# Altium schematic sheet Strum.SchDoc
size A; SheetNumber: 1; SheetTotal: 1
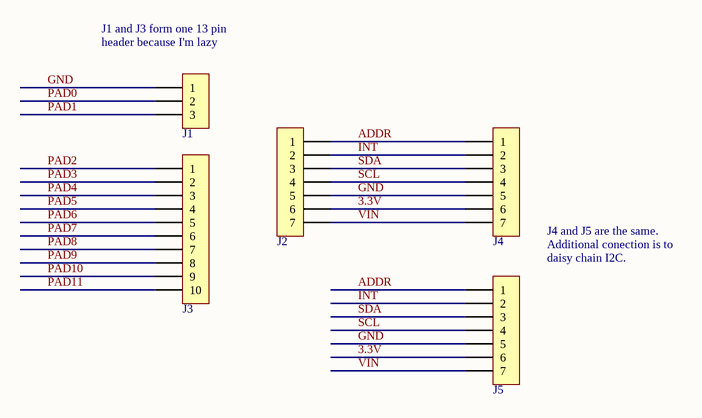
[diagram p0: Strum.SchDoc]

## Parts
J1  3-644456-3  [TE_3-644456-3]  (value not drawn)
J2  3-644456-7  [TE_3-644456-7]  (value not drawn)
J3  4-644456-0  [TE_4-644456-0]  (value not drawn)
J4  3-644456-7  [TE_3-644456-7]  (value not drawn)
J5  3-644456-7  [TE_3-644456-7]  (value not drawn)

## Nets
3.3V: J2.6 J4.6 J5.6
ADDR: J2.1 J4.1 J5.1
GND: J1.1 J2.5 J4.5 J5.5
INT: J2.2 J4.2 J5.2
PAD0: J1.2
PAD1: J1.3
PAD2: J3.1
PAD3: J3.2
PAD4: J3.3
PAD5: J3.4
PAD6: J3.5
PAD7: J3.6
PAD8: J3.7
PAD9: J3.8
PAD10: J3.9
PAD11: J3.10
SCL: J2.4 J4.4 J5.4
SDA: J2.3 J4.3 J5.3
VIN: J2.7 J4.7 J5.7

## Notes on the sheet
- (near J1) J1 and J3 form one 13 pin header because I'm lazy
- J4 and J5 are the same. Additional conection is to daisy chain I2C.

## Library data of the parts
J1 = 3-644456-3: CONN HEADER VERT 3POS .100 TIN; Manufacturer: TE Connectivity; Connector Type: Header, Unshrouded; Number of Positions: 3; Number of Positions Loaded: All; Pitch: 0.100" (2.54mm); PartNumber: 3-644456-3; Supplier 1: Digi-Key; Supplier 2: Mouser; Supplier Part Number 2: 571-3-644456-3; HelpURL: http://www.te.com/commerce/DocumentDelivery/DDEController?Action=srchrtrv&DocNm=644456&DocType=Customer+Drawing&DocLang=English; Supplier Part Number 1: A31113-ND; Manufacturer Part Number: 3-644456-3; Series: MTA-100, AMP; Contact Type: Male Pin; Number of Rows: 1; Row Spacing: -; Contact Mating Length: 0.295" (7.49mm); Mounting Type: Through Hole; Termination: Solder; Fastening Type: -; Features: -; Contact Finish: Tin; Contact Finish Thickness: 150µin (3.81µm); Color: Natural
J2 J4 J5 = 3-644456-7: CONN HEADER VERT 7POS .100 TIN; Manufacturer: TE Connectivity; Connector Type: Header, Unshrouded; Number of Positions: 7; Number of Positions Loaded: All; Pitch: 0.100" (2.54mm); PartNumber: 3-644456-7; Supplier 1: Digi-Key; Supplier 2: Mouser; Supplier Part Number 2: 571-3-644456-7; HelpURL: http://www.te.com/commerce/DocumentDelivery/DDEController?Action=srchrtrv&DocNm=644456&DocType=Customer+Drawing&DocLang=English; Supplier Part Number 1: A31117-ND; Manufacturer Part Number: 3-644456-7; Series: MTA-100, AMP; Contact Type: Male Pin; Number of Rows: 1; Row Spacing: -; Contact Mating Length: 0.295" (7.49mm); Mounting Type: Through Hole; Termination: Solder; Fastening Type: -; Features: -; Contact Finish: Tin; Contact Finish Thickness: 150µin (3.81µm); Color: Natural
J3 = 4-644456-0: CONN HEADER VERT 10POS .100 TIN; Manufacturer: TE Connectivity AMP Connectors; Factory Stock: 0; Unit Price (USD): 0.63; Minimum Quantity: 1; Connector Type: Header, Unshrouded; Number of Positions: 10; Number of Positions Loaded: All; Pitch: 0.100" (2.54mm); PartNumber: 4-644456-0; Supplier 1: Digi-Key; Supplier 2: Mouser; Supplier Part Number 2: 571-4-644456-0; HelpURL: http://www.te.com/commerce/DocumentDelivery/DDEController?Action=srchrtrv&DocNm=644456&DocType=Customer+Drawing&DocLang=English; Image: http://media.digikey.com/photos/Tyco%20Amp%20Photos/1-644456-0,%204-644456-0,%201-644695-0,%204-644695-0.jpg; Supplier Part Number 1: A30844-ND; Manufacturer Part Number: 4-644456-0; Quantity Available: 6514; @ qty: 0; Packaging: Bulk; Series: MTA-100; Contact Type: Male Pin; Number of Rows: 1; Row Spacing: -; Contact Mating Length: 0.295" (7.49mm); Mounting Type: Through Hole; Termination: Solder; Fastening Type: -; Features: -; Contact Finish: Tin; Contact Finish Thickness: 150µin (3.81µm); Color: Natural